# EAGLE design crystal-test-breakout-mk-2 (EAGLE 6.5.0)
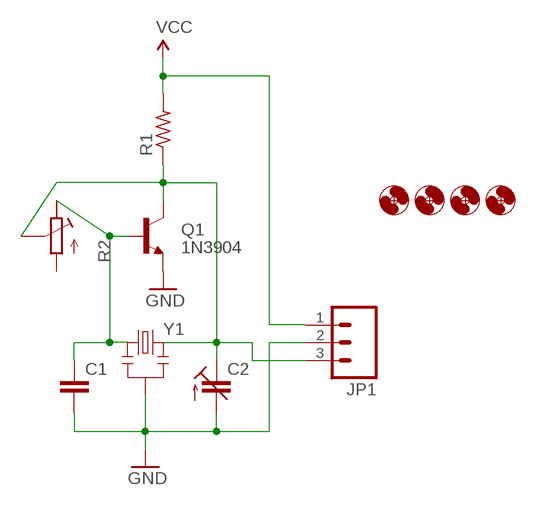
[diagram p0: schematic, sheet 1]

## Parts
C1  CAPACITOR-CERAMIC025-025X050  [C025-025X050]
C2  CAPACITOR-TRIM3040.427  [CTRIM3040.427]
H1  HOLE#2  [HOLE-#2]
H2  HOLE#2  [HOLE-#2]
H3  HOLE#2  [HOLE-#2]
H4  HOLE#2  [HOLE-#2]
JP1  M03PTH  [1X03]
Q1  1N3904  TRANSISTOR_NPNTO-92-AMMO-EBC  [TO-92-AMMO]
R1  RESISTORPTH-AXIAL-5.08MM  [RESISTOR-AXIAL-PTH-5.08MM]
R2  POTENTIOMETER3296W  [RTRIM3296W]
Y1  RESONATORPTH-BIGHOLES  [RESONATOR-PTH-BIGHOLES]

## Nets
GND: C1.2 C2.2(A) JP1.2 Q1.1(E) Y1.2
N$1: C1.1 Q1.2(B) R2.3(E) Y1.1
N$4: C2.1A(E) C2.1B(E) JP1.3 Q1.3(C) R1.P$1 R2.2(S) Y1.3
VCC: JP1.1 R1.P$2
Unconnected: R2.1(A)

## Library data of the parts
C1 = A_butts:CAPACITOR-CERAMIC: CAPACITOR, European symbol
C2 = A_butts:CAPACITOR-TRIM: Trimm capacitor
H1-H4 = A_butts:HOLE: MOUNTING HOLE with drill center marker
JP1 = A_butts:M03: Header 3 Standard 3-pin 0.1" header. Use with straight break away headers (SKU : PRT-00116), right angle break away headers (PRT-00553), swiss pins (PRT-00743), machine pins (PRT-00117), and female headers (PRT-00115). Molex polarized connector foot print use with SKU : PRT-08232 with associated crimp pins and housings.
Q1 = A_butts:TRANSISTOR_NPN: Generic NPN BJT MMBT2222A - TRANS-08049 (SOT-23, 1A 40V) MPSA42 - TRANS-09116 (SOT-23, 500mA 300V) MMBT5088LT1G - TRANS-11160 (SOT-23, 50 mA 30V) BC547 - COM-08928 <http://www.sparkfun.com/products/8928> (TO-92 45V 100mA) (1.Collector 2.Base 3.Emitter) 2N3904 - COM-00521 <http://www.sparkfun.com/products/521> (TO-92 40V 200mA) (1.Emitter 2.Base 3.Collector) P2N2222A - COM-12852 <http://www.sparkfun.com/products/12852> (TO-92 40V 600mA) (1.Collector 2.Base 3.Emitter)
R1 = A_butts:RESISTOR: RESISTOR, American symbol
R2 = A_butts:POTENTIOMETER: Trimm resistor
Y1 = A_butts:RESONATOR: Resonator Small SMD resonator. Used, eg, on the Arduino Pro/ Pro Mini boards. 8MHz- XTAL-08895 16MHz- XTAL-08900

## Board
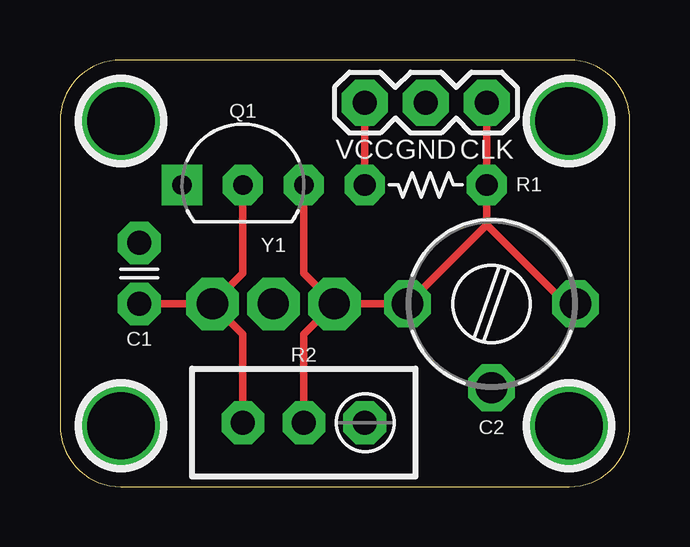
[diagram p1: board, top side]
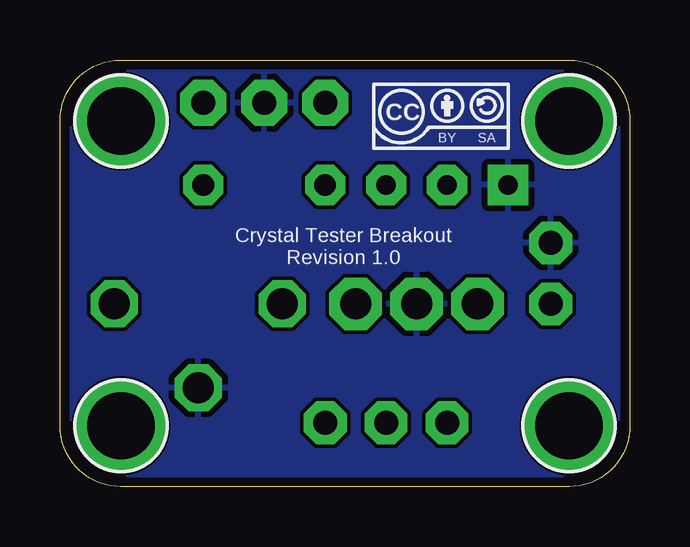
[diagram p2: board, bottom side, seen from below]

Size 23.75 x 17.78 mm. Coordinates in mm from the lower left corner, seen from the top.
Outline: 0,15.24 0,2.54 arc90 2.54,0 21.21,0 arc90 23.75,2.54 23.75,15.24 arc90 21.21,17.78 2.54,17.78 arc90 0,15.24
Copper layers (1*16): Top 0.0356mm / dielectric 1.5011mm / Bottom 0.0356mm
Design rules "LaenPCBOrder_2": minimum track width 6mil, minimum drill 13mil, track to track 6mil, track to pad 6mil, pad to pad 6mil, via to via 6mil, smd to smd 6mil, copper to edge 15mil, drill to drill 6mil, minimum pad ring 7mil, minimum via ring 7mil, stop-mask expansion 3mil, vias tented up to drill 20mil, thermal gap 10mil

### Footprints (pad centres in the part's own frame; a part is rotated, then mirrored left to right if it is on the bottom)
C025-025X050 = drill 1 pad 1.778 octagon: 1 -1.27,0; 2 1.27,0
CTRIM3040.427 = drill 1.3 octagon: 1A -3.5,0; 1B 3.5,0; 2 0,-3.5
HOLE-#2 = drill 2.8 pad 3.81: P$1 0,0
1X03 = drill 1 pad 1.93 octagon: 1 0,0; 2 2.54,0; 3 5.08,0
TO-92-AMMO = drill 0.813 pad 1.676 square: 1 -2.54,0 | drill 0.813 pad 1.676 octagon: 2 0,0; 3 2.54,0
RESISTOR-AXIAL-PTH-5.08MM = drill 0.9 pad 1.676 octagon: P$1 -2.54,0; P$2 2.54,0
RTRIM3296W = drill 1 pad 1.778 octagon: 1 -2.54,0; 2 0,0; 3 2.54,0
RESONATOR-PTH-BIGHOLES = drill 1.3 pad 2.184 octagon: 1 -2.54,0; 2 0,0; 3 2.54,0

### Placement (x,y rotation side)
C1  3.3,8.89 90 top
C2  17.98,7.62 0 top
H1  2.54,15.24 0 top
H2  21.21,15.24 0 top
H3  2.54,2.54 0 top
H4  21.21,2.54 0 top
JP1  12.7,16 0 top
Q1  7.62,12.57 0 top
R1  15.24,12.57 180 top
R2  10.16,2.67 180 top
U$1  [CC-BY-SA-4.0-NO-URL]  9.53,15.62 0 bottom
Y1  8.89,7.62 0 top

### Tracks (layer width: path | path; a pad name or v marks a point on that pad's centre or on a via)
GND
  pour Bottom: 2.54,17.78 21.21,17.78 arc-90 23.75,15.24 23.75,2.54 arc-90 21.21,0 2.54,0 arc-90 0,2.54 0,15.24 arc-90
N$1
  Top 0.305: Q1.2 7.62,8.89 Y1.1 | Y1.1 7.62,6.35 R2.3 | C1.1 Y1.1
N$4
  Top 0.305: Y1.3 10.16,8.89 Q1.3 | Y1.3 10.16,6.35 R2.2 | 17.78,10.92 C2.1A Y1.3 | 17.78,10.92 R1.P$1 JP1.3 | 17.78,10.92 21.08,7.62 C2.1B
VCC
  Top 0.305: JP1.1 R1.P$2

### Text on the board
tPlace: VCC | GND | CLK
bPlace: Crystal Tester Breakout / Revision 1.0